# EAGLE schematic overallPCB (EAGLE 9.0.0)
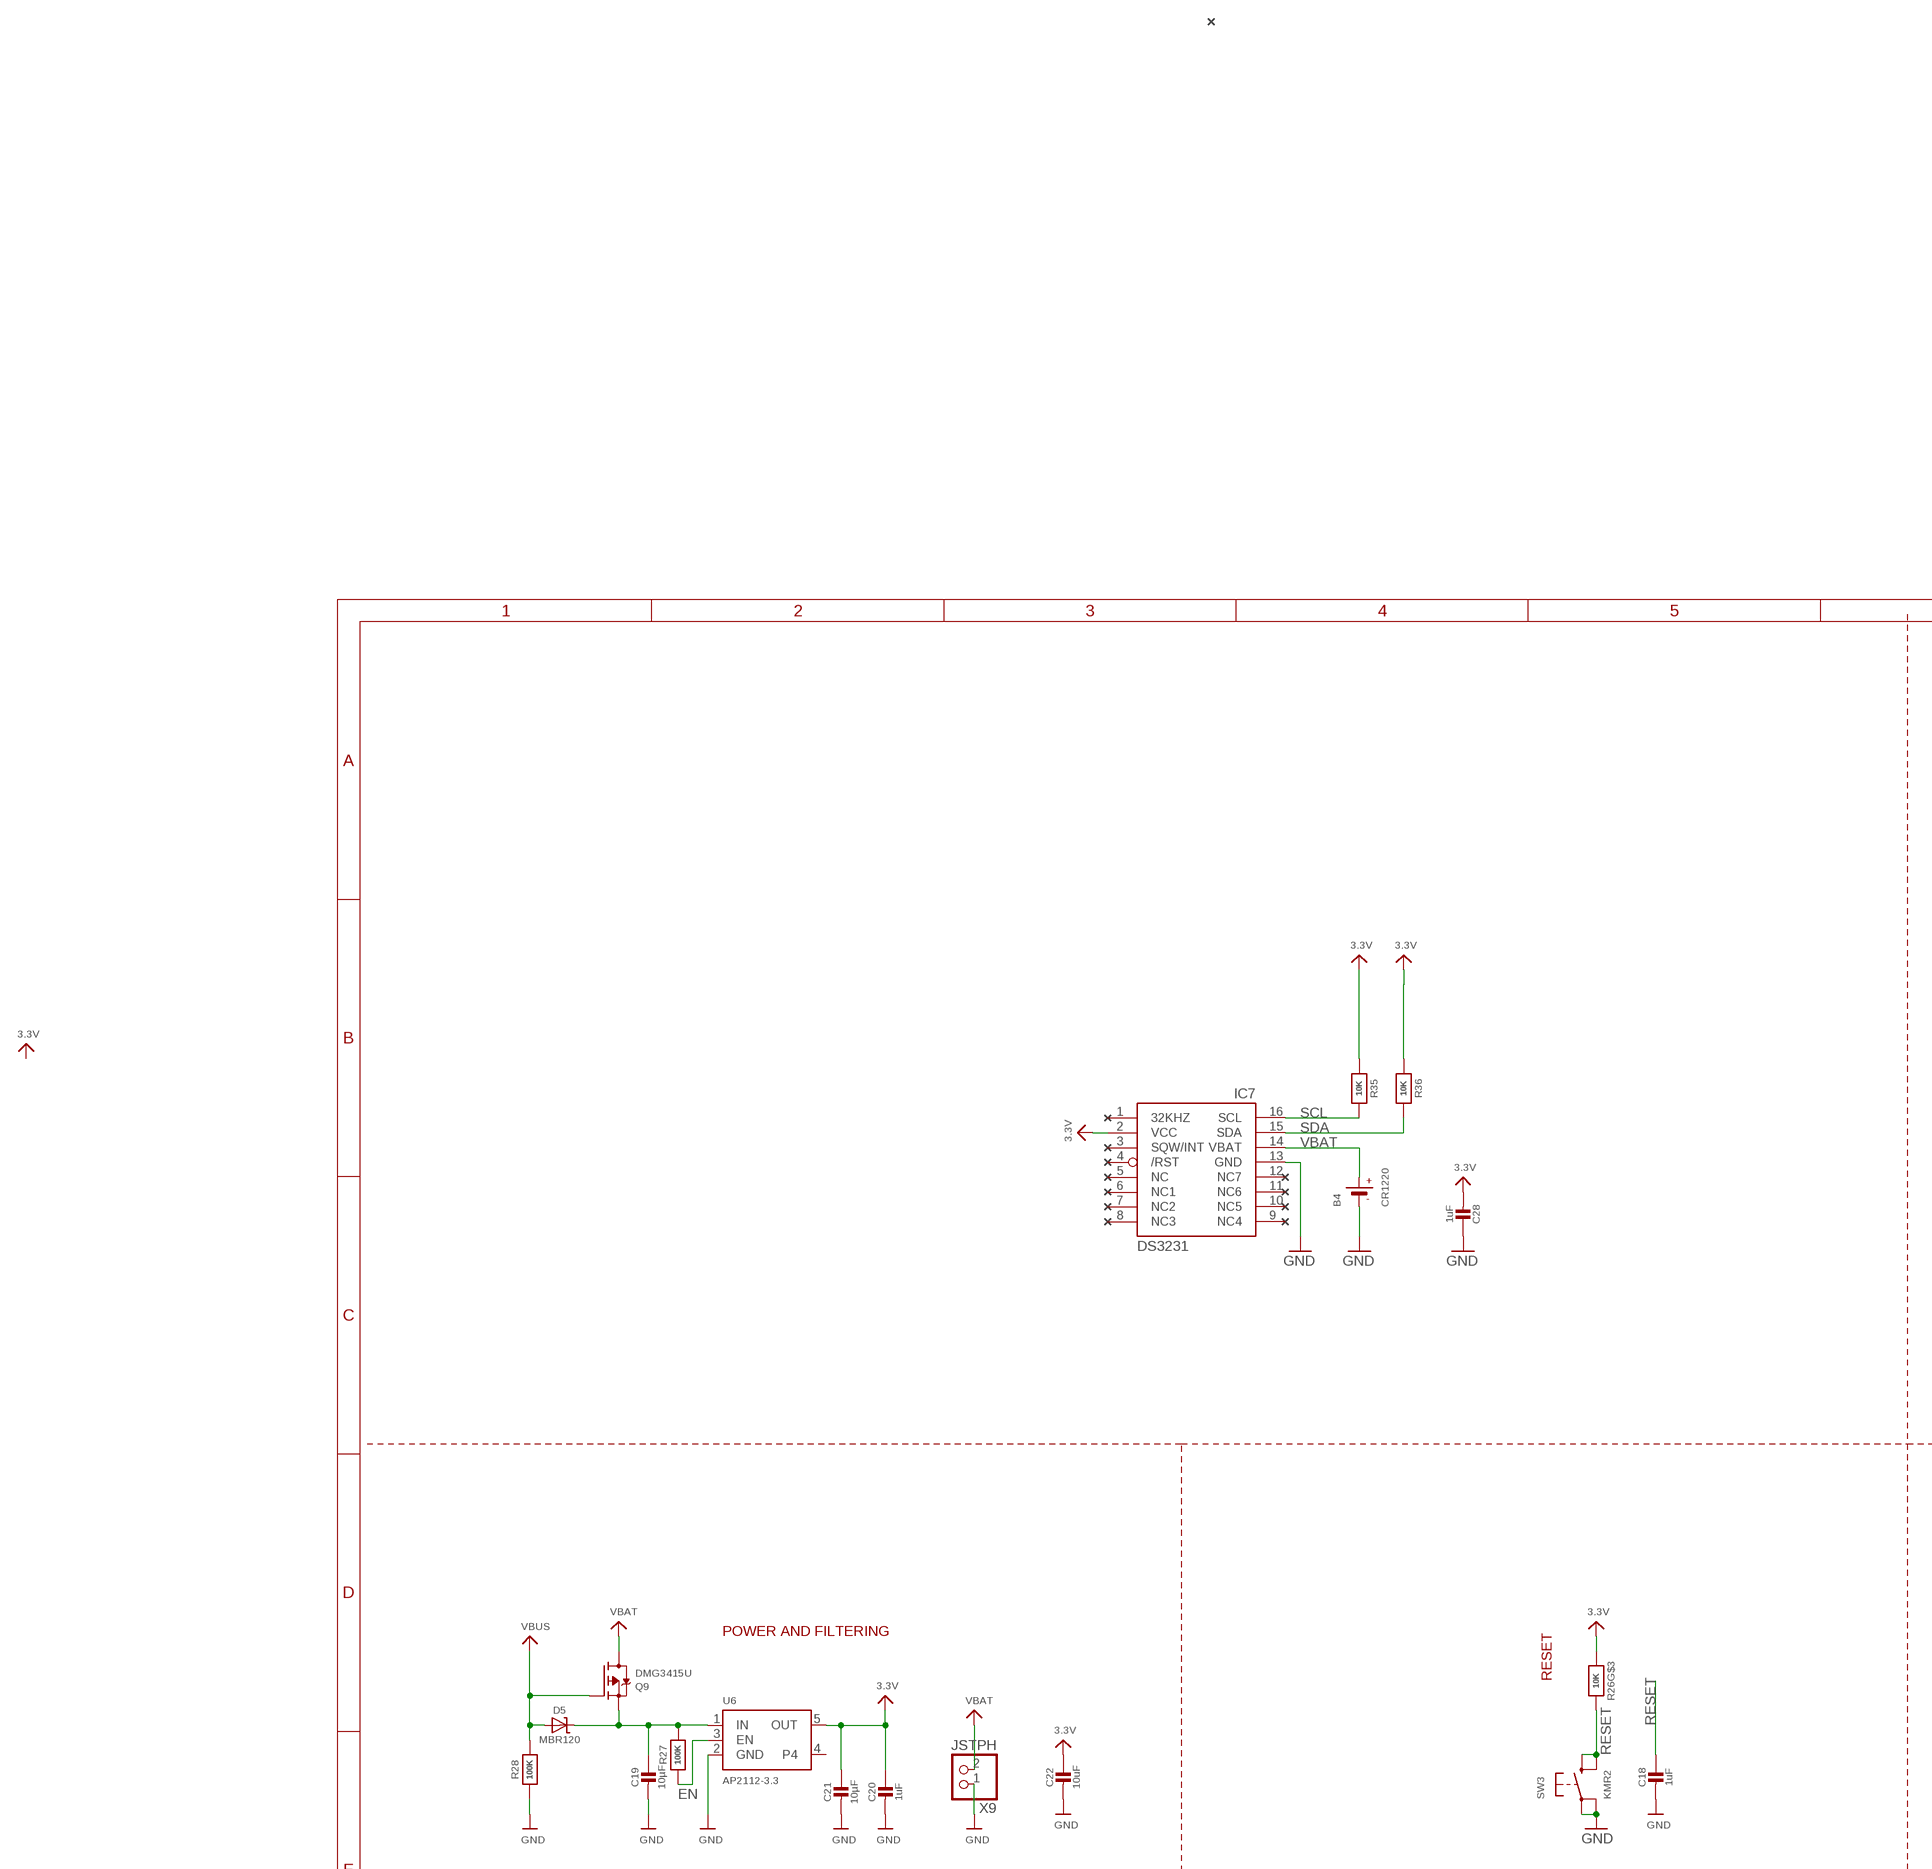
[diagram p0: schematic, sheet 1, part 1 of 3]
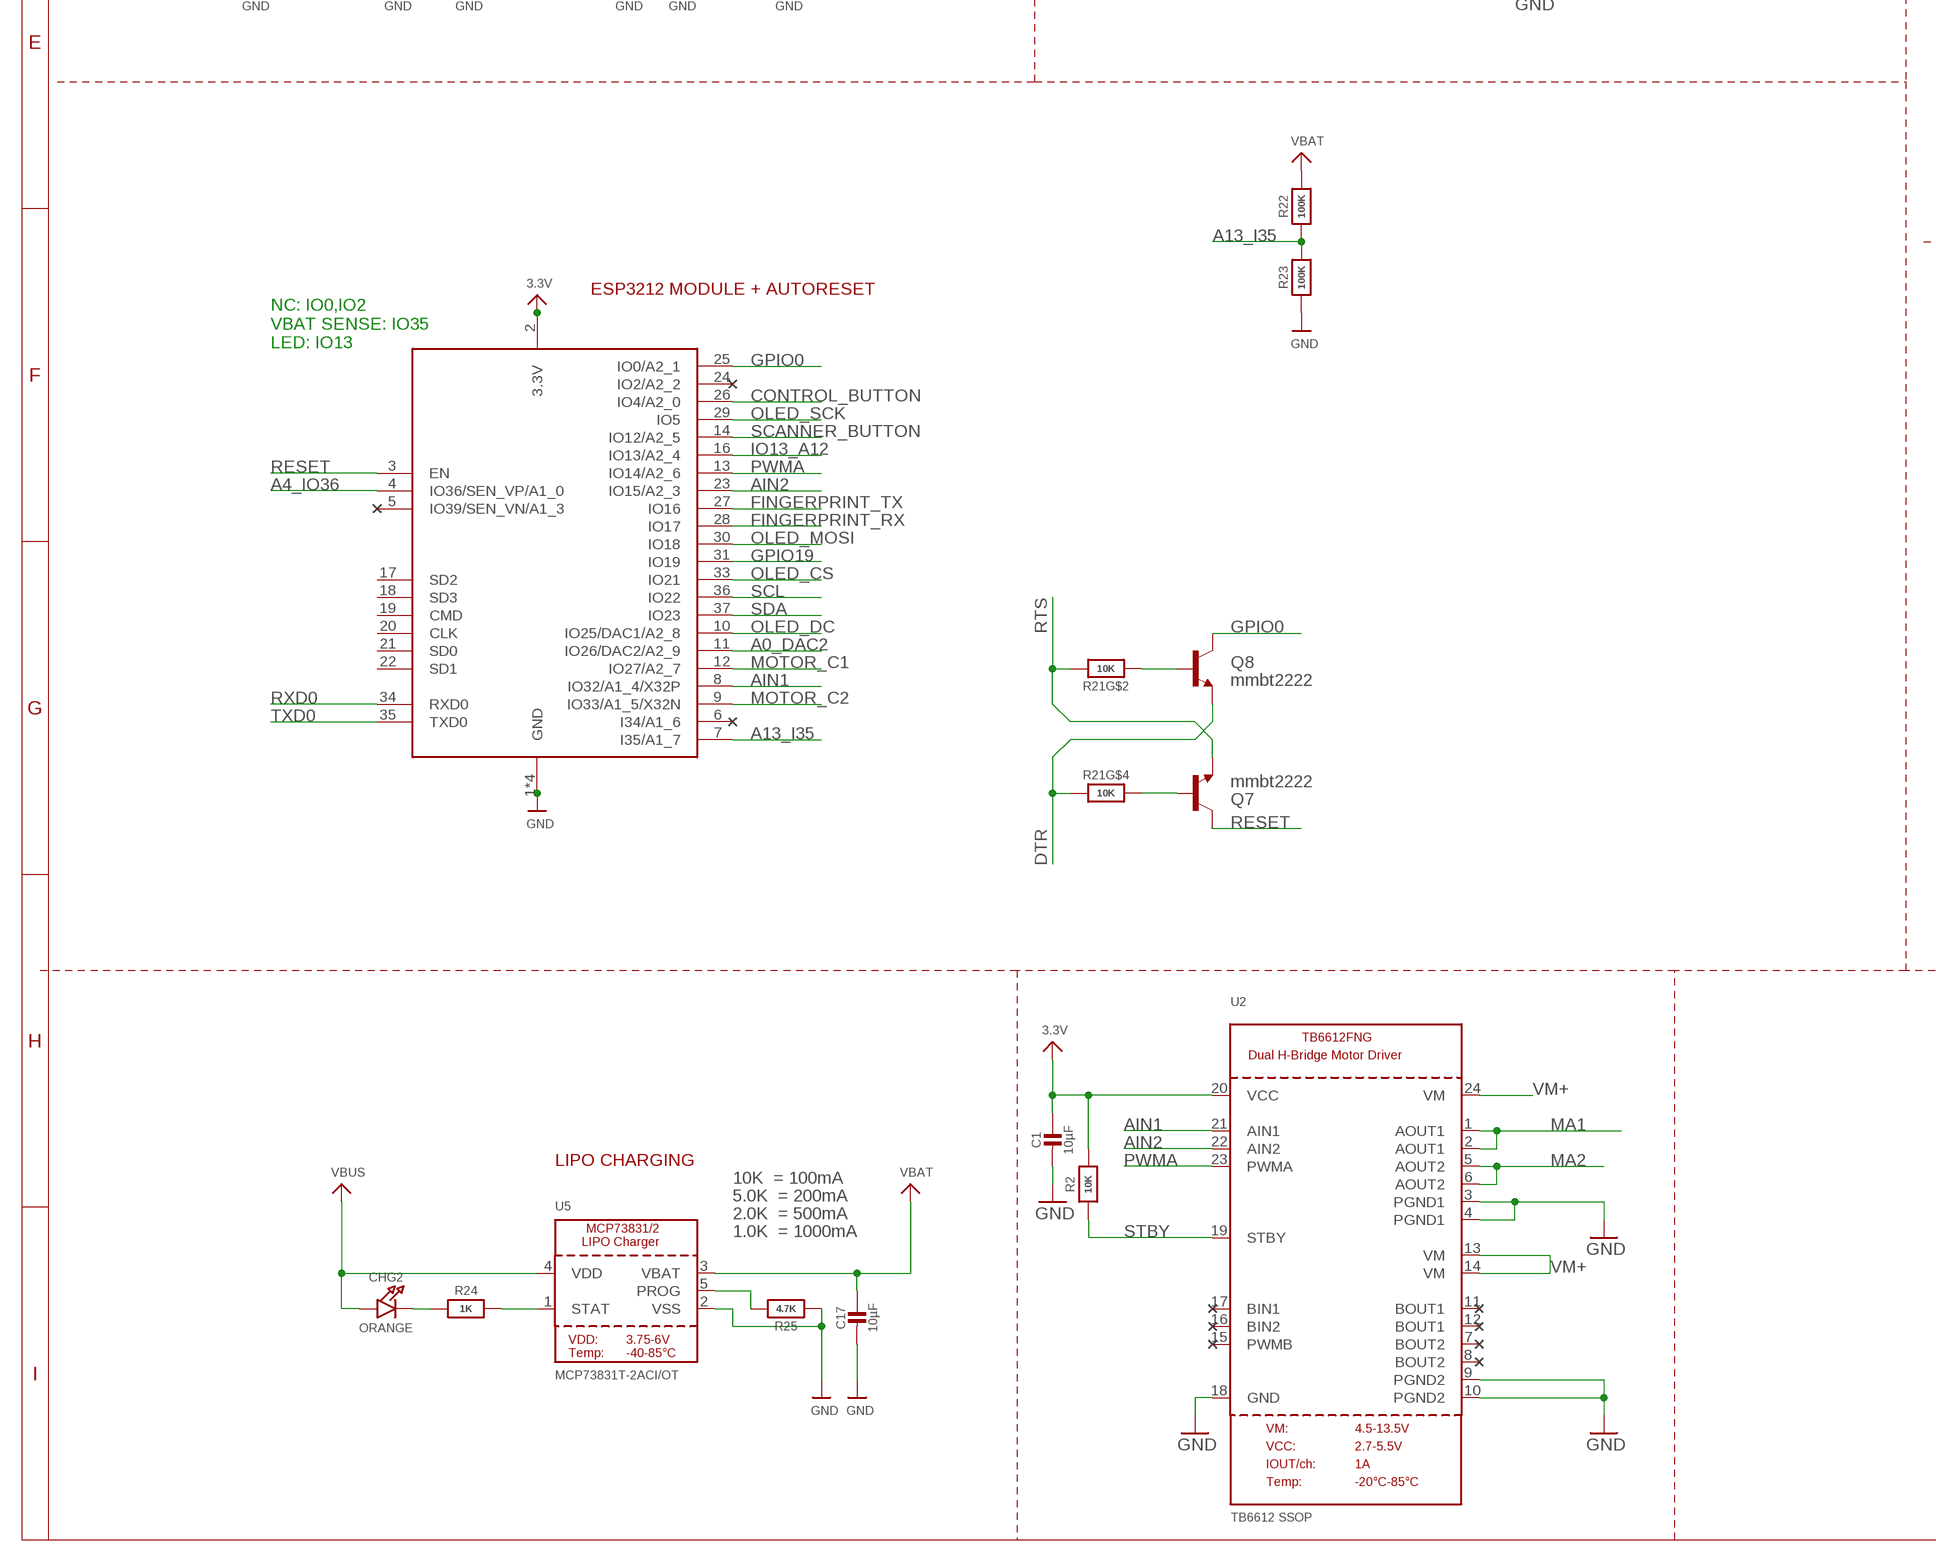
[diagram p1: schematic, sheet 1, part 2 of 3]
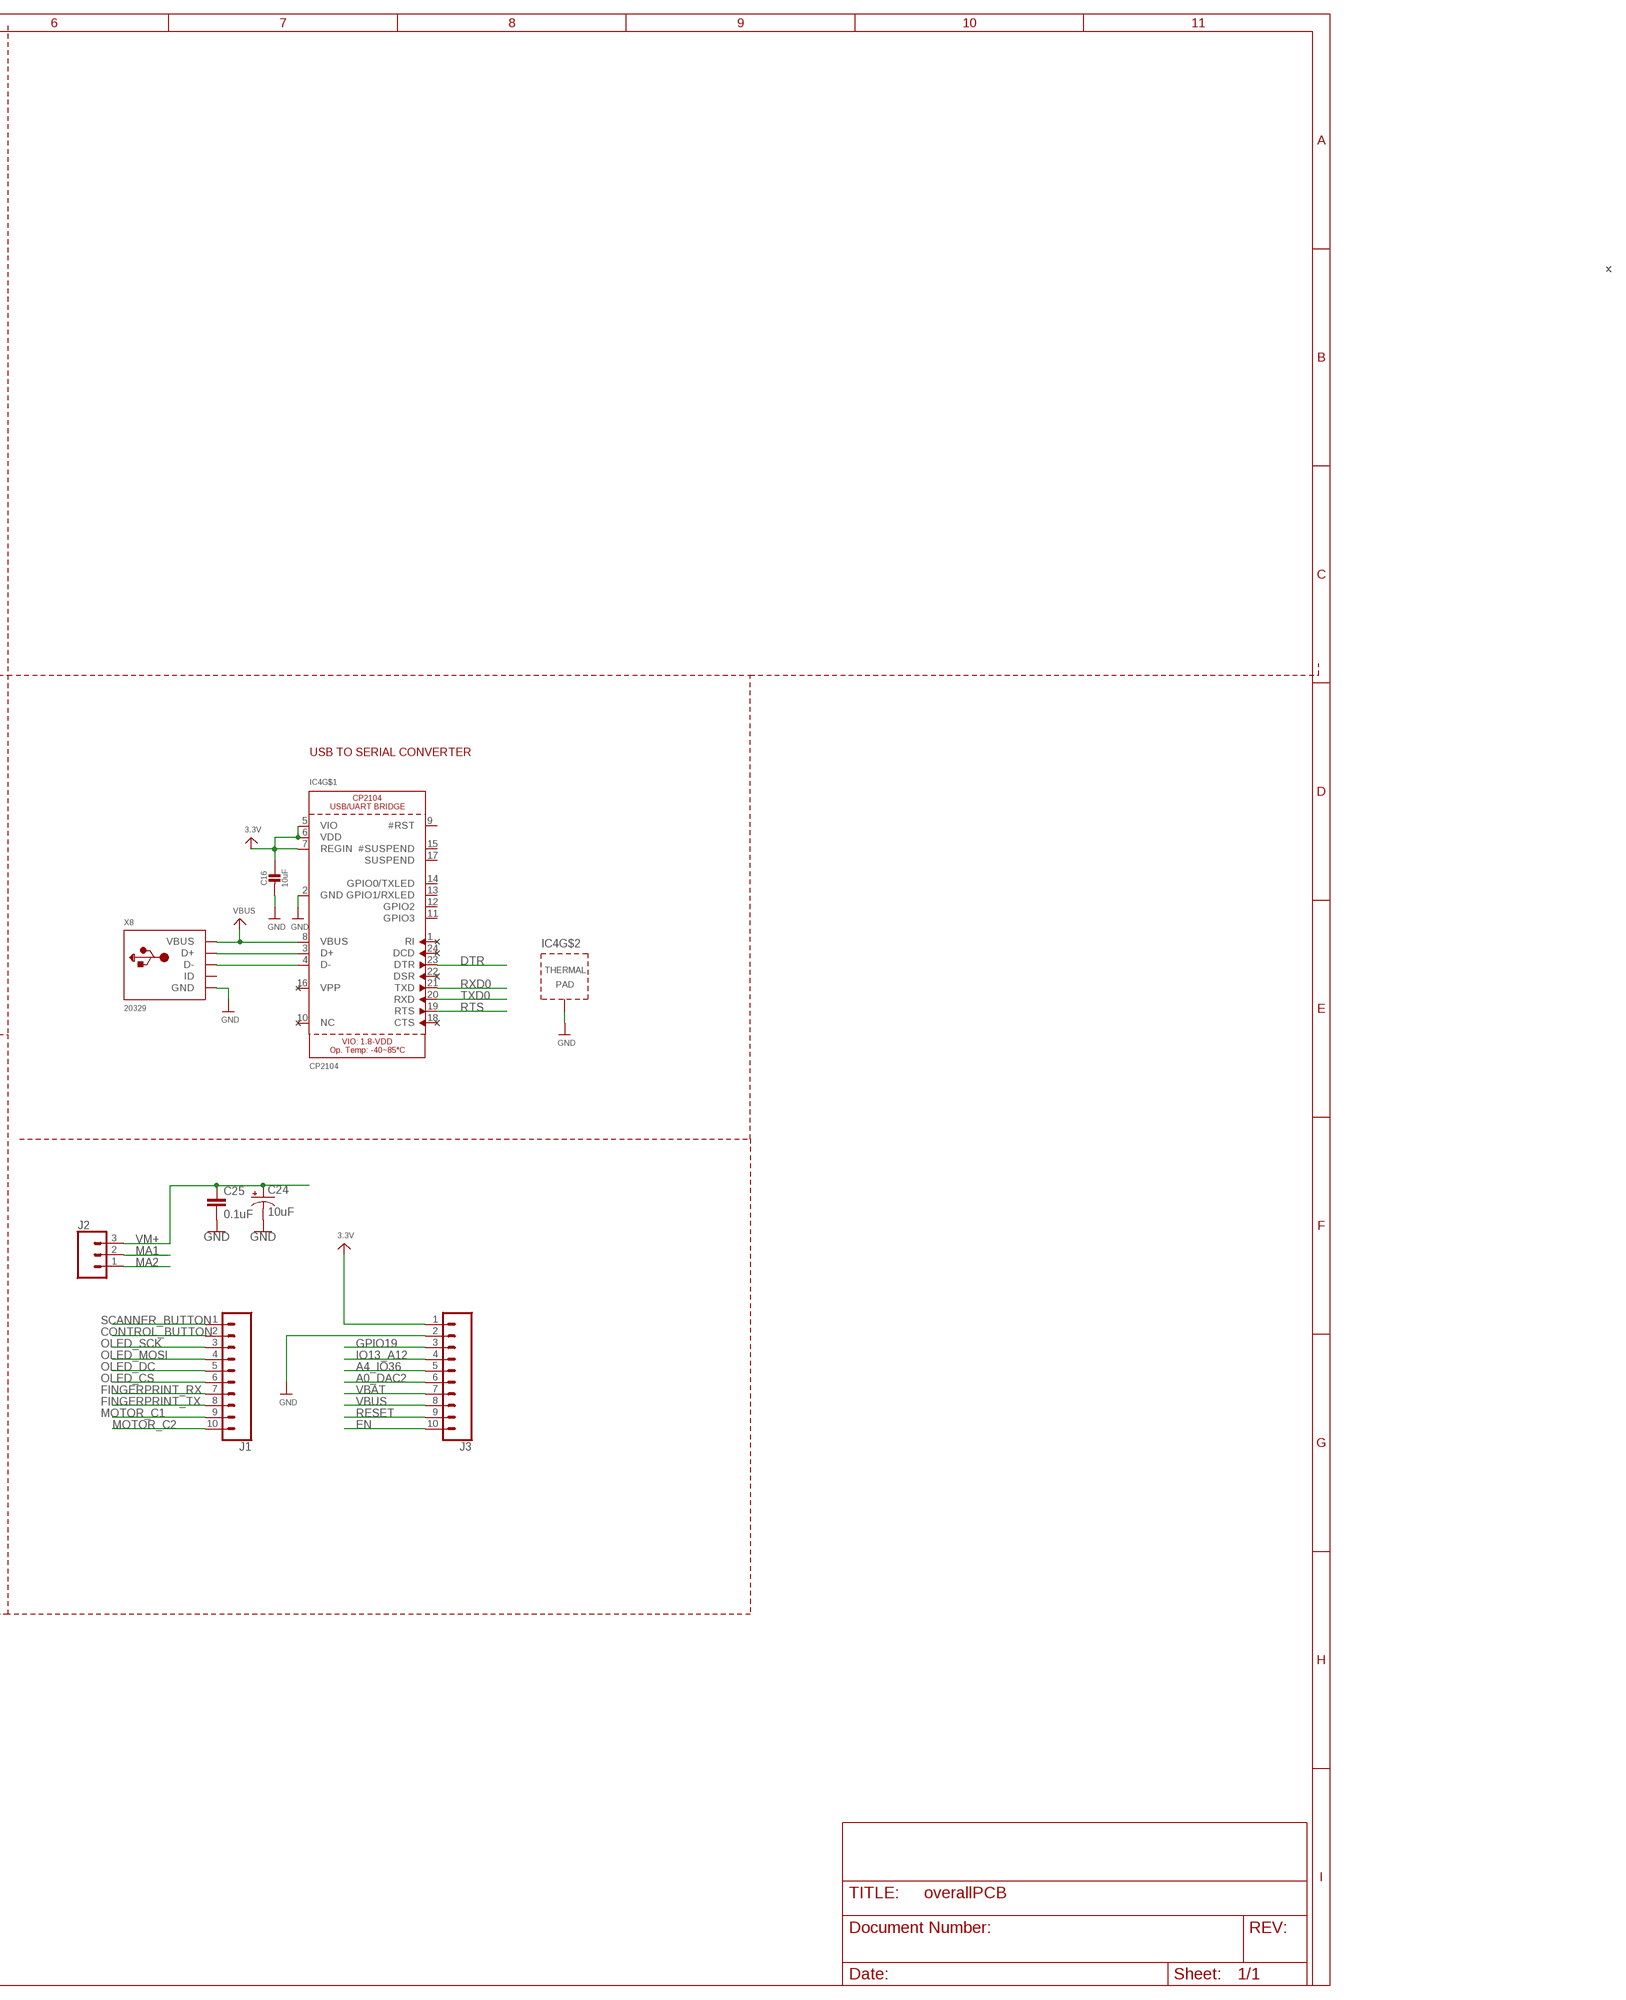
[diagram p2: schematic, sheet 1, part 3 of 3]

## Parts
B4  CR1220  BATTERYCR1220_SMT  [CR1220]
C1  10µF  CAP_CERAMIC0805-NOOUTLINE  [0805-NO]
C16  10uF  CAP_CERAMIC0805-NOOUTLINE  [0805-NO]
C17  10µF  CAP_CERAMIC0805-NOOUTLINE  [0805-NO]
C18  1uF  CAP_CERAMIC0603_NO  [0603-NO]
C19  10µF  CAP_CERAMIC0805-NOOUTLINE  [0805-NO]
C20  1uF  CAP_CERAMIC0603_NO  [0603-NO]
C21  10µF  CAP_CERAMIC0805-NOOUTLINE  [0805-NO]
C22  10uF  CAP_CERAMIC0805-NOOUTLINE  [0805-NO]
C24  10uF  10UF-POLAR-EIA3216-16V-10%(TANT)  [EIA3216]
C25  0.1uF  0.1UF-0402-16V-10%  [0402]
C28  1uF  CAP_CERAMIC0805-NOOUTLINE  [0805-NO]
CHG2  ORANGE  LED0805_NOOUTLINE  [CHIPLED_0805_NOOUTLINE]
D5  MBR120  DIODE-SCHOTTKYSOD-123  [SOD-123]
IC4  CP2104  [QFN24_4MM_SMSC]
IC7  DS3231/SO  [SO16W]
J1  CONN_10"  [1X10]
J2  CONN_03POGO_PIN_HOLES_ONLY  [1X03_PP_HOLES_ONLY]
J3  CONN_10"  [1X10]
Q7  mmbt2222  TRANSISTOR_NPNSOT23-3  [SOT23-3]
Q8  mmbt2222  TRANSISTOR_NPNSOT23-3  [SOT23-3]
Q9  DMG3415U  MOSFET-P  [SOT23-R]
R2  10K  RESISTOR0805_NOOUTLINE  [0805-NO]
R21  10K  RESISTOR_4PACK  [RESPACK_4X0603]
R22  100K  RESISTOR_0603_NOOUT  [0603-NO]
R23  100K  RESISTOR_0603_NOOUT  [0603-NO]
R24  1K  RESISTOR_0603_NOOUT  [0603-NO]
R25  4.7K  RESISTOR_0603_NOOUT  [0603-NO]
R26  10K  RESISTOR_4PACK  [RESPACK_4X0603]
R27  100K  RESISTOR_0603_NOOUT  [0603-NO]
R28  100K  RESISTOR_0603_NOOUT  [0603-NO]
R35  10K  RESISTOR0805_NOOUTLINE  [0805-NO]
R36  10K  RESISTOR0805_NOOUTLINE  [0805-NO]
SW3  KMR2  SWITCH_TACT_SMT4.6X2.8  [BTN_KMR2_4.6X2.8]
U2  TB6612 SSOP  TB6612FNGSSOP  [SSOP24]
U5  MCP73831T-2ACI/OT  MCP73831/2  [SOT23-5]
U6  AP2112-3.3  VREG_SOT23-5  [SOT23-5]
X7  ESP32_WROOM32_SKINNY  [WROOM32_SKINNY]
X8  20329  USB_MICRO_20329_V2  [4UCONN_20329_V2]
X9  JSTPH  CON_JST_PH_2PIN  [JSTPH2]

## Nets
3.3V: C1.1 C16.1 C20.1 C21.1 C22.1 C28.2 IC4.5(VIO) IC4.6(VDD) IC4.7(REGIN) IC7.2(VCC) J3.1 R2.2 R26.3 R35.1 R36.1 U2.20(VCC) U6.5(OUT) X7.2(3.3V)
A0_DAC2: J3.6 X7.11(IO26/DAC2/A2_9)
A4_IO36: J3.5 X7.4(IO36/SEN_VP/A1_0)
A13_I35: R22.1 R23.2 X7.7(I35/A1_7)
AIN1: U2.21(AIN1) X7.8(IO32/A1_4/X32P)
AIN2: U2.22(AIN2) X7.23(IO15/A2_3)
CONTROL_BUTTON: J1.2 X7.26(IO4/A2_0)
DTR: IC4.23(DTR) Q8.2(E) R21.4
EN: J3.10 R27.1 U6.3(EN)
FINGERPRINT_RX: J1.7 X7.28(IO17)
FINGERPRINT_TX: J1.8 X7.27(IO16)
GND: B4.- C1.2 C16.2 C17.2 C18.2 C19.2 C20.2 C21.2 C22.2 C24.- C25.2 C28.1 IC4.2(GND) IC4.THERM(TP) IC7.13(GND) J3.2 R23.1 R25.1 R28.1 SW3.A'(P1) SW3.A(P) U2.3(PGND1) U2.4(PGND1) U2.9(PGND2) U2.10(PGND2) U2.18(GND) U5.2(VSS) U6.2(GND) X7.1(GND) X7.15(GND) X7.38(GND) X7.P$1(GND) X8.BASE@1(GND) X8.BASE@2(GND) X8.GND X8.SPRT@1(GND) X8.SPRT@2(GND) X8.SPRT@3(GND) X8.SPRT@4(GND) X9.1
GPIO0: Q8.3(C) X7.25(IO0/A2_1)
GPIO19: J3.3 X7.31(IO19)
IO13_A12: J3.4 X7.16(IO13/A2_4)
MA1: J2.2 U2.1(AOUT1) U2.2(AOUT1)
MA2: J2.1 U2.5(AOUT2) U2.6(AOUT2)
MOTOR_C1: J1.9 X7.12(IO27/A2_7)
MOTOR_C2: J1.10 X7.9(IO33/A1_5/X32N)
N$19: Q7.1(B) R21.5
N$20: Q8.1(B) R21.2
N$21: IC4.3(D+) X8.D+
N$22: IC4.4(D-) X8.D-
N$23: CHG2.C R24.1
N$24: R24.2 U5.1(STAT)
N$25: R25.2 U5.5(PROG)
N$26: C19.1 D5.C Q9.2(S) R27.2 U6.1(IN)
OLED_CS: J1.6 X7.33(IO21)
OLED_DC: J1.5 X7.10(IO25/DAC1/A2_8)
OLED_MOSI: J1.4 X7.30(IO18)
OLED_SCK: J1.3 X7.29(IO5)
PWMA: U2.23(PWMA) X7.13(IO14/A2_6)
RESET: C18.1 J3.9 Q7.3(C) R26.6 SW3.B'(S1) SW3.B(S) X7.3(EN)
RTS: IC4.19(RTS) Q7.2(E) R21.7
RXD0: IC4.21(TXD) X7.34(RXD0)
SCANNER_BUTTON: J1.1 X7.14(IO12/A2_5)
SCL: IC7.16(SCL) R35.2 X7.36(IO22)
SDA: IC7.15(SDA) R36.2 X7.37(IO23)
STBY: R2.1 U2.19(STBY)
TXD0: IC4.20(RXD) X7.35(TXD0)
VBAT: B4.+$1(+) C17.1 IC7.14(VBAT) J3.7 Q9.3(D) R22.2 U5.3(VBAT) X9.2
VBUS: CHG2.A D5.A IC4.8(VBUS) J3.8 Q9.1(G) R28.2 U5.4(VDD) X8.VBUS
VM+: C24.+ C25.1 J2.3 U2.13(VM) U2.14(VM) U2.24(VM)
Unconnected: IC4.1(RI) IC4.9(#RST) IC4.10(NC) IC4.11(GPIO3) IC4.12(GPIO2) IC4.13(GPIO1/RXLED) IC4.14(GPIO0/TXLED) IC4.15(#SUSPEND) IC4.16(VPP) IC4.17(SUSPEND) IC4.18(CTS) IC4.22(DSR) IC4.24(DCD) IC7.1(32KHZ) IC7.3(SQW/INT) IC7.4(/RST) IC7.5(NC) IC7.6(NC1) IC7.7(NC2) IC7.8(NC3) IC7.9(NC4) IC7.10(NC5) IC7.11(NC6) IC7.12(NC7) R21.1 R21.3 R21.6 R21.8 R26.1 R26.2 R26.4 R26.5 R26.7 R26.8 U2.7(BOUT2) U2.8(BOUT2) U2.11(BOUT1) U2.12(BOUT1) U2.15(PWMB) U2.16(BIN2) U2.17(BIN1) U6.4 X7.5(IO39/SEN_VN/A1_3) X7.6(I34/A1_6) X7.17(SD2) X7.18(SD3) X7.19(CMD) X7.20(CLK) X7.21(SD0) X7.22(SD1) X7.24(IO2/A2_2) X8.ID

## Notes on the sheet
- USB TO SERIAL CONVERTER
- POWER AND FILTERING
- RESET
- ESP3212 MODULE + AUTORESET
- NC: IO0,IO2
  VBAT SENSE: IO35
  LED: IO13
- LIPO CHARGING
- 10K  = 100mA
- 5.0K  = 200mA
- 2.0K  = 500mA
- 1.0K  = 1000mA

## Library data of the parts
B4 = microbuilder:BATTERY: CR1220 SMT - Digikey: 3001K-ND CD2032 BAT-HLD-001 - Digikey: BAT-HLD-001-ND
C1 C16-C22 C28 = microbuilder:CAP_CERAMIC: Ceramic Capacitors For new designs, use the packages preceded by an '_' character since they are more reliable: The following footprints should be used on most boards: _0402 - Standard footprint for regular board layouts _0603 - Standard footprint for regular board layouts _0805 - Standard footprint for regular board layouts _1206 - Standard footprint for regular board layouts For extremely tight-pitch boards where space is at a premium, the following 'micro-pitch' footprints can be used (smaller pads, no silkscreen outline, etc.): _0402MP - Micro-pitch footprint for very dense/compact boards _0603MP - Micro-pitch footprint for very dense/compact boards _0805MP - Micro-pitch footprint for very dense/compact boards _1206MP - Micro-pitch footprint for very dense/compact boards
C24 = SparkFun-Capacitors:10UF-POLAR: 10.0µF polarized capacitors A capacitor is a passive two-terminal electrical component used to store electrical energy temporarily in an electric field.; PROD_ID: CAP-00811
C25 = SparkFun-Capacitors:0.1UF: 0.1µF ceramic capacitors A capacitor is a passive two-terminal electrical component used to store electrical energy temporarily in an electric field.; PROD_ID: CAP-12416
CHG2 = microbuilder:LED: LED 0603 - 0603 Surface Mount Package 2mA: Green LED - Low Power (3.9mcd, 2ma, 1.7Vf) - Digikey: 475-2709-2-ND Orange LED - Low Power (9.8mcd, 2ma, 1.8Vf) - Digikey: 475-1194-2-ND Red LED - Low Power (5mcd, 2ma, 1.8Vf) - Digikey: 475-1195-2-ND Yellow LED - Low Power (7mcd, 2ma, 1.8Vf) - Digikey: 475-1196-2-ND 5mA: Blue LED - Low Power (17mcd, 5ma, 2.9Vf) - Digikey: LNJ937W8CRACT-ND 0805 - 0805 Surface Mount Package 2mA: Red LED (8.8mcd, 2mA, 1.8Vf, Clear) - Low Power [Digikey: 475-2510-1-ND] Green LED (5mcd, 2mA, 1.8Vf, Clear) - Low Power [Digikey: 475-2730-1-ND] Yellow LED (11.3mcd, 2mA, 1.8Vf, Clear) - Low Power [Digikey: 475-2555-1-ND] 20mA: Red LED (104mcd, 20mA, Diffused) - LS R976 [Digikey: 475-1278-6-ND] Red LED (12mcd, 20mA, 2.0Vf, Clear) - APT2012EC [Digikey: 754-1128-1-ND] Green LED (15mcd, 20mA, 2.2Vf, Clear) - APT2012GC [Digikey: 754-1131-1-ND] Orange LED (160mcd, 20mA, 2.1Vf, Clear) - APT2012SECK [Digikey: 754-1130-1-ND] 1206 - 1206 Surface Mount Package Green LED (26mcd, 20mA, Diffused) - LG N971 [Digikey: 475-1407-6-ND] Red LED (15mcd, 20mA, Diffused) - LH N974 [Digikey: 475-1416-6-ND] Cree - Cree High-Power Surface Mount LEDs XPEBWT-L1-0000-00D50 - White 111lm 350mA 2.9Vf 6200K 110° XTEAWT-00-0000-00000LEE3 - White 114lm 350mA 2.85Vf 5000K 115° Everlight - Everlight 45-21 Series Surface Mount LEDs 45-21/QK2C-B2832AC2CB2/2T - Warm White 2000mcd 20mA 3.25Vf 3050K 120° 45-21/LK2C-B38452C4CB2/2T - Nuetral White 2000mcd 20mA 3.25Vf 4150K 120° 45-21/LK2C-B50634C6CB2/2T - Cold White 2200mcd 20mA 3.25Vf 5650K 120° PLCC2 Reverse Mount LS T77K-J1L2-1-0-2-R18-Z - Red 11.25mcd 2mA 1.8Vf 630nm 120° LO T77K-L1M2-24-Z - Orange 19.6mcd 2mA 1.8Vf 606nm 120° LY T77K-K2M1-26-Z - Yellow 15.7mcd 2mA 1.8Vf 587nm 120°
D5 = microbuilder:DIODE-SCHOTTKY
IC4 = microbuilder:CP2104: CP2104 - USB to UART Bridge VDD Output: 3.45V
IC7 = adafruit:DS3231
J1 J3 = SparkFun-Connectors:CONN_10: Multi connection point. Often used as Generic Header-pin footprint for 0.1 inch spaced/style header connections On any of the 0.1 inch spaced packages, you can populate with these: Break Away Headers - Straight <https://www.sparkfun.com/products/116> (PRT-00116) Break Away Male Headers - Right Angle <https://www.sparkfun.com/products/553> (PRT-00553) Female Headers <https://www.sparkfun.com/products/115> (PRT-00115) Break Away Headers - Machine Pin <https://www.sparkfun.com/products/117> (PRT-00117) Break Away Female Headers - Swiss Machine Pin <https://www.sparkfun.com/products/743> (PRT-00743) Arduino Stackable Header - 10 Pin <https://www.sparkfun.com/products/11376> (PRT-11376) For SCREWTERMINALS and SPRING TERMINALS visit here: Screw Terimnals on SparkFun.com <https://www.sparkfun.com/search/results?term=Screw+Terminals> (5mm/3.5mm/2.54mm spacing) This device is also useful as a general connection point to wire up your design to another part of your project. Our various solder wires solder well into these plated through hole pads. Hook-Up Wire - Assortment (Stranded, 22 AWG) <https://www.sparkfun.com/products/11375> (PRT-11375) Hook-Up Wire - Assortment (Solid Core, 22 AWG) <https://www.sparkfun.com/products/11367> (PRT-11367) View the entire wire category on our website here <https://www.sparkfun.com/categories/141> Special notes: Molex polarized connector foot print use with SKU : PRT-08231 with associated crimp pins and housings. 1MM SMD Version SKU: PRT-10208 NOTES ON THE VARIANTS LOCK and LOCK_LONGPADS... This footprint was designed to help hold the alignment of a through-hole component (i.e. 6-pin header) while soldering it into place. You may notice that each hole has been shifted either up or down by 0.005 of an inch from it's more standard position (which is a perfectly straight line). This slight alteration caused the pins (the squares in the middle) to touch the edges of the holes. Because they are alternating, it causes a "brace" to hold the component in place. 0.005 has proven to be the perfect amount of "off-center" position when using our standard breakaway headers. Although looks a little odd when you look at the bare footprint, once you have a header in there, the alteration is very hard to notice. Also,if you push a header all the way into place, it is covered up entirely on the bottom side.; PROD_ID: CONN-11563
J2 = SparkFun-Connectors:CONN_03: Multi connection point. Often used as Generic Header-pin footprint for 0.1 inch spaced/style header connections On any of the 0.1 inch spaced packages, you can populate with these: Break Away Headers - Straight <https://www.sparkfun.com/products/116> (PRT-00116) Break Away Male Headers - Right Angle <https://www.sparkfun.com/products/553> (PRT-00553) Female Headers <https://www.sparkfun.com/products/115> (PRT-00115) Break Away Headers - Machine Pin <https://www.sparkfun.com/products/117> (PRT-00117) Break Away Female Headers - Swiss Machine Pin <https://www.sparkfun.com/products/743> (PRT-00743) Stackable Header - 3 Pin (Female, 0.1") <https://www.sparkfun.com/products/13875> (PRT-13875) For SCREWTERMINALS and SPRING TERMINALS visit here: Screw Terimnals on SparkFun.com <https://www.sparkfun.com/search/results?term=Screw+Terminals> (5mm/3.5mm/2.54mm spacing) This device is also useful as a general connection point to wire up your design to another part of your project. Our various solder wires solder well into these plated through hole pads. Hook-Up Wire - Assortment (Stranded, 22 AWG) <https://www.sparkfun.com/products/11375> (PRT-11375) Hook-Up Wire - Assortment (Solid Core, 22 AWG) <https://www.sparkfun.com/products/11367> (PRT-11367) View the entire wire category on our website here <https://www.sparkfun.com/categories/141> Special notes: Molex polarized connector foot print use with SKU : PRT-08232 with associated crimp pins and housings.
Q7 Q8 = SparkFun:TRANSISTOR_NPN: Transistor NPN BJT configuration in SOT23 package. MMBT2222 is the common NPN we use. Double check BCE configuration again layout.
Q9 = microbuilder:MOSFET-P: P-Channel Mosfet LEGEND VDS: Voltage Drain-Source ID: Drain Current RDS(ON): Drain-Source On-State Resistance VGS(TH): Gate-Source Threshold Voltage CISS: Drain-Source Input Capacitance SOT-23 Name VDS ID RDS(ON) VGS(TH) CISS Order Number IRLML5103 30V 760mA 600 mOhm -- 75pF @ 25V Digikey: IRLML5103PBFCT-ND IRLML6401 12V 4.3A 50 mOhm 950mV @ 250µA 830pF @ 10V Digikey: IRLML6401PBFTR-ND NTR0202PL 20V 400mA 800 mOhm 2.3V @ 250uA 70pF @ 5V Digikey: NTR0202PLT1GOSTR-ND NTR4101PT1G 20V 1.8A 85 mOhm 1.2V @ 250uA 675pF @ 10V Digikey: NTR4101PT1GOSCT-ND DMP2004K 20V 600mA 900 mOhm 1V @ 250uA 175pF @ 16V Digikey: DMP2004KDICT-ND PMV65XP 20V 3.9A 76 mOhm 950mV @ 1mA 725pF @ 20V Digikey: 568-2358-2-ND TO-252 Name VDS ID RDS(ON) VGS(TH) CISS Order Number AOD417 30V 25A 34 mOhm 3V @ 250µA 920pF @ 15V Digikey: 785-1106-2-ND
R2 R22-R25 R27 R28 R35 R36 = microbuilder:RESISTOR: Resistors For new designs, use the packages preceded by an '_' character since they are more reliable: The following footprints should be used on most boards: _0402 - Standard footprint for regular board layouts _0603 - Standard footprint for regular board layouts _0805 - Standard footprint for regular board layouts _1206 - Standard footprint for regular board layouts For extremely tight-pitch boards where space is at a premium, the following 'micro-pitch' footprints can be used (smaller pads, no silkscreen outline, etc.): _0402MP - Micro-pitch footprint for very dense/compact boards _0603MP - Micro-pitch footprint for very dense/compact boards _0805MP - Micro-pitch footprint for very dense/compact boards _1206MP - Micro-pitch footprint for very dense/compact boards
R21 R26 = microbuilder:RESISTOR_4PACK: Resistor Packs (4 resistors) 4 x 0603 10K 1/16W - Digikey: YC164J-10KCT-ND
SW3 = microbuilder:SWITCH_TACT_SMT: SMT Tact Switches 6x6mm - Digikey: P12940SCT-ND KMR2 (4.6x2.8mm) - Digikey: 401-1426-1-ND EVQ-PQHB55 - Light Touch, 160GF (4.5x4.5mm) - Digikey: P8090SCT-ND KMT0 - KMT021 NGJ LHS (etc.) IP68/Waterproof - Digikey: CKN10289CT-ND
U2 = microbuilder:TB6612FNG: TB6612FNG Dual H-Bridge Motor Driver
U5 = microbuilder:MCP73831/2: MCP73831/2 LIPO Charger VDD: 3.75 - 6V Temp -40 - 85°C Programmable Charge Rate: 15-500mA NOTE: STAT is a tri-state logic output on the MCP73831 and an open-drain output on the MCP73832. SOT23-5 with 4.2V output and tri-state logic on STAT = MCP73831T-2ACI/OT
U6 = microbuilder:VREG_SOT23-5: SOT23-5 Fixed Voltage Regulators Part Current Out V Out V In V Dropout θJA (°C/W) TJ (°C) Digikey Part No. ADP121 150mA 3.3V 3.4-5.5V 0.09V @ 150mA -- -- ADP121-AUJZ33R7CT-ND ADP121 150mA 3.0V 3.1-5.5V 0.09V @ 150mA -- -- ADP121-AUJZ30R7CT-ND ADP122 300mA 3.3V 3.4-5.5V 0.085V @ 300mA -- -- ADP122AUJZ-3.3-R7CT-ND ADP1712 300mA 3.3V 3.5-5.5V 0.17V @ 300mA -- -- ADP1712AUJZ-3.3-R7TR-ND AP7311 (Low Cost) 150mA 3.3V 3.5-6V 0.15V @ 150mA -- -- AP7311-33WG-7DICT-ND LD39015M18R 150mA 1.8V 1.9V-5.5V 0.08V @ 100mA -- -- 497-6977-1-ND LP2985A-33DBVR 150mA 3.3V 3.3-16V 0.28V @ 150mA 206 150 296-18479-1-ND MCP1824T-3302E/OT 300mA 3.3V 3.5V-6V 0.2V @ 300mA -- -- MCP1824T-3302E/OTCT-ND MIC5205-2.5YM5 TR 150mA 2.5V 2.7-16V 0.165V @ 150mA -- -- 576-1257-2-ND MIC5205-3.0YM5 TR 150mA 3.0V 3.2V-16V 0.165V @ 150mA -- -- 576-1258-2-ND MIC5205-3.3YM5 TR 150mA 3.3V 3.5V-16V 0.165V @ 150mA -- -- 576-1259-2-ND TPS780330220 150mA 3.3V+2.2V 3.6-5.5V 250mV Max -- -- 296-23332-1-ND TDA3663/N1,135 100mA 3.3V 3.5-45V 0.18V @ 50mA -- -- 568-5343-1-ND Max operating temp can be calculated using θJA, TJ (max junction temperature), and power in watts. Set the "Maximum Ambient Temperature" until it reaches TJ ("Max Junction Temperature"), which is the absolute limit for safe use of the regulator: Heat Sink Temperature Calculator <http://www.daycounter.com/Calculators/Heat-Sink-Temperature-Calculator.phtml> For example, With 12V source into a 3.3V LP2985 and a 30mA load, we are dissipating (12V-3.3V) * 0.03A = 0.261W. With a θJA of 206 °C/W, a TJ of 150°C, and 261mW we can safely use the chip without a heat sink up to 75°C (=147.1°C Junction Temperature).
X7 = microbuilder:ESP32_WROOM32
X8 = microbuilder:USB: USB Connectors USBMINIB - Surface Mount Female Mini-B USB Connector 4UConnector: 06564
X9 = microbuilder:CON_JST_PH_2PIN: JST 2-Pin Right-Angle Connector PH-Series - 4UConnector: 17311 SH-Series - 4UConnector: 07278